# Altium schematic sheet Sheet1.schdoc
size A4
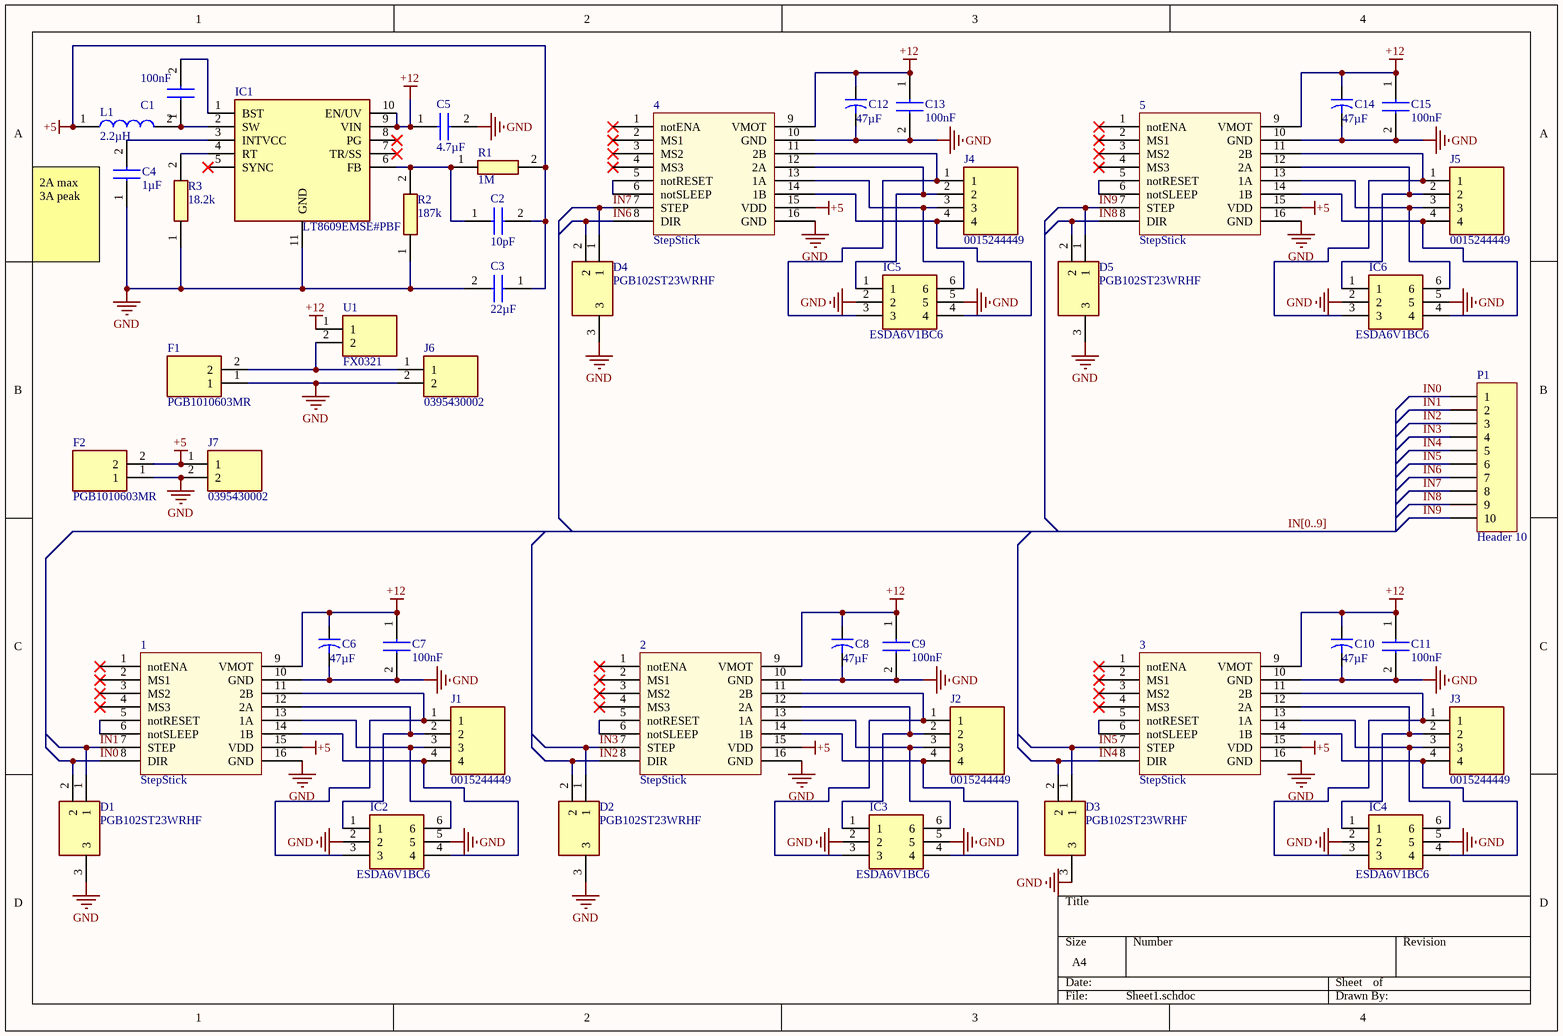
[diagram p0: Sheet1.schdoc]

## Parts
1  StepStick  [StepStick]
2  StepStick  [StepStick]
3  StepStick  [StepStick]
4  StepStick  [StepStick]
5  StepStick  [StepStick]
C1  100nF  [CAPC1608X95N]
C2  10pF  [CAPC1608X95N]
C3  22µF  [CAPC1608X95N]
C4  1µF  [CAPC1608X95N]
C5  4.7µF  [CAPC1608X95N]
C6  value 47µF  [CAPR5-4X5]
C7  100nF  [CAPC0603X33N]
C8  value 47µF  [CAPR5-4X5]
C9  100nF  [CAPC0603X33N]
C10  value 47µF  [CAPR5-4X5]
C11  100nF  [CAPC0603X33N]
C12  value 47µF  [CAPR5-4X5]
C13  100nF  [CAPC0603X33N]
C14  value 47µF  [CAPR5-4X5]
C15  100nF  [CAPC0603X33N]
D1  PGB102ST23WRHF  [PGB102ST23WRHF]
D2  PGB102ST23WRHF  [PGB102ST23WRHF]
D3  PGB102ST23WRHF  [PGB102ST23WRHF]
D4  PGB102ST23WRHF  [PGB102ST23WRHF]
D5  PGB102ST23WRHF  [PGB102ST23WRHF]
F1  PGB1010603MR  [FUSC1708X36N]
F2  PGB1010603MR  [FUSC1708X36N]
IC1  LT8609EMSE#PBF  [SOP50P490X110-11N]
IC2  ESDA6V1BC6  [SOT95P280X145-6N]
IC3  ESDA6V1BC6  [SOT95P280X145-6N]
IC4  ESDA6V1BC6  [SOT95P280X145-6N]
IC5  ESDA6V1BC6  [SOT95P280X145-6N]
IC6  ESDA6V1BC6  [SOT95P280X145-6N]
J1  0015244449  [0015244449]
J2  0015244449  [0015244449]
J3  0015244449  [0015244449]
J4  0015244449  [0015244449]
J5  0015244449  [0015244449]
J6  0395430002  [SHDR2W100P0X500_1X2_1000X950X1490P]
J7  0395430002  [SHDR2W100P0X500_1X2_1000X950X1490P]
L1  2.2µH  [WE-TPC_8015/801292]
P1  Header 10  [HDR1X10]
R1  1M  [RESC1608X55N]
R2  187k  [RESC1608X55N]
R3  18.2k  [RESC1608X55N]
U1  FX0321  [FX0321]

## Nets
+5: 1.15(VDD) 2.15(VDD) 3.15(VDD) 4.15(VDD) 5.15(VDD) C2.2 C3.1 F2.2 J7.1 L1.1 R1.2
+12: 1.9(VMOT) 2.9(VMOT) 3.9(VMOT) 4.9(VMOT) 5.9(VMOT) C5.1 C6.1 C7.1 C8.1 C9.1 C10.1 C11.1 C12.1 C13.1 C14.1 C15.1 IC1.9(VIN) IC1.10(EN/UV) U1.1
GND: 1.10(GND) 1.16(GND) 2.10(GND) 2.16(GND) 3.10(GND) 3.16(GND) 4.10(GND) 4.16(GND) 5.10(GND) 5.16(GND) C3.2 C4.1 C5.2 C6.2 C7.2 C8.2 C9.2 C10.2 C11.2 C12.2 C13.2 C14.2 C15.2 D1.3 D2.3 D3.3 D4.3 D5.3 F1.1 F2.1 IC1.11(GND) IC2.2 IC2.5 IC3.2 IC3.5 IC4.2 IC4.5 IC5.2 IC5.5 IC6.2 IC6.5 J6.2 J7.2 R2.1 R3.1
IN0: 1.8(DIR) D1.2 P1.1
IN1: 1.7(STEP) D1.1 P1.2
IN2: 2.8(DIR) D2.2 P1.3
IN3: 2.7(STEP) D2.1 P1.4
IN4: 3.8(DIR) D3.2 P1.5
IN5: 3.7(STEP) D3.1 P1.6
IN6: 4.8(DIR) D4.2 P1.7
IN7: 4.7(STEP) D4.1 P1.8
IN8: 5.8(DIR) D5.2 P1.9
IN9: 5.7(STEP) D5.1 P1.10
Net1_5: 1.5(notRESET) 1.6(notSLEEP)
Net1_11: 1.11(2B) IC2.3 J1.1
Net1_12: 1.12(2A) IC2.1 J1.2
Net1_13: 1.13(1A) IC2.6 J1.3
Net1_14: 1.14(1B) IC2.4 J1.4
Net2_5: 2.5(notRESET) 2.6(notSLEEP)
Net2_11: 2.11(2B) IC3.3 J2.1
Net2_12: 2.12(2A) IC3.1 J2.2
Net2_13: 2.13(1A) IC3.6 J2.3
Net2_14: 2.14(1B) IC3.4 J2.4
Net3_5: 3.5(notRESET) 3.6(notSLEEP)
Net3_11: 3.11(2B) IC4.3 J3.1
Net3_12: 3.12(2A) IC4.1 J3.2
Net3_13: 3.13(1A) IC4.6 J3.3
Net3_14: 3.14(1B) IC4.4 J3.4
Net4_5: 4.5(notRESET) 4.6(notSLEEP)
Net4_11: 4.11(2B) IC5.3 J4.1
Net4_12: 4.12(2A) IC5.1 J4.2
Net4_13: 4.13(1A) IC5.6 J4.3
Net4_14: 4.14(1B) IC5.4 J4.4
Net5_5: 5.5(notRESET) 5.6(notSLEEP)
Net5_11: 5.11(2B) IC6.3 J5.1
Net5_12: 5.12(2A) IC6.1 J5.2
Net5_13: 5.13(1A) IC6.6 J5.3
Net5_14: 5.14(1B) IC6.4 J5.4
NetC1_1: C1.1 IC1.2(SW) L1.2
NetC1_2: C1.2 IC1.1(BST)
NetC2_1: C2.1 IC1.6(FB) R1.1 R2.2
NetC4_2: C4.2 IC1.3(INTVCC)
NetF1_2: F1.2 J6.1 U1.2
NetIC1_4: IC1.4(RT) R3.2

Not connected (* = marked no-connect by the designer): 1 1(notENA)* 2(MS1)* 3(MS2)* 4(MS3)*; 2 1(notENA)* 2(MS1)* 3(MS2)* 4(MS3)*; 3 1(notENA)* 2(MS1)* 3(MS2)* 4(MS3)*; 4 1(notENA)* 2(MS1)* 3(MS2)* 4(MS3)*; 5 1(notENA)* 2(MS1)* 3(MS2)* 4(MS3)*; IC1 5(SYNC)* 7(TR/SS)* 8(PG)*

## Buses and harness runs
bus IN[0..9]

## Notes on the sheet
- 2A max 3A peak

## Library data of the parts
C1-C5 = C0603C104K3RACTU: Capacitor; Manufacturer_Name: Kemet; Allied_Number: 70095458; Datasheet Link: https://content.kemet.com/datasheets/KEM_C1002_X7R_SMD.pdf; Height: 0.95mm; Manufacturer_Part_Number: C0603C104K3RACTU; Mouser Part Number: 80-C0603C104K3R; Mouser Price/Stock: https://www.mouser.com/Search/Refine.aspx?Keyword=80-C0603C104K3R; RS Part Number: 0147538P; RS Price/Stock: http://uk.rs-online.com/web/p/products/0147538P; Allied Price/Stock: https://www.alliedelec.com/kemet-c0603c104k3ractu/70095458/
C6 C8 C10 C12 C14 = Cap2: Capacitor; Published: 23-Sep-2002; PackageReference: CAPR5-4X5; Publisher: Altium Limited; PackageDescription: Capacitor; 2 Leads
C7 C9 C11 C13 C15 = 02016D104KAT2A: Capacitor; Manufacturer_Name: AVX; Allied_Number: 70001761; Datasheet Link: http://www.mouser.com/catalog/supplier/library/pdf/AVXSurfaceMountCeramic.pdf; Height: 0.33mm; Manufacturer_Part_Number: 02016D104KAT2A; Mouser Part Number: 581-02016D104KAT2A; Mouser Price/Stock: https://www.mouser.com/Search/Refine.aspx?Keyword=581-02016D104KAT2A; RS Part Number: 6982995P; RS Price/Stock: http://uk.rs-online.com/web/p/products/6982995P; Allied Price/Stock: https://www.alliedelec.com/avx-02016d104kat2a/70001761/
D1-D5 = PGB102ST23WRHF: Diode; Manufacturer_Name: LITTELFUSE; Allied_Number: 70519251; Datasheet Link: https://www.arrow.com/en/products/pgb102st23wrhf/littelfuse; Height: 0.79mm; Manufacturer_Part_Number: PGB102ST23WRHF; Mouser Part Number: 576-PGB102ST23WRHF; Mouser Price/Stock: https://www.mouser.com/Search/Refine.aspx?Keyword=576-PGB102ST23WRHF; Allied Price/Stock: https://www.alliedelec.com/littelfuse-pgb102st23wrhf/70519251/
F1 F2 = PGB1010603MR: Fuse; Manufacturer_Name: LITTELFUSE; Allied_Number: 70184374; Datasheet Link: http://uk.rs-online.com/web/p/products/7383191; Height: 0.36mm; Manufacturer_Part_Number: PGB1010603MR; Mouser Part Number: 576-PGB1010603MR; Mouser Price/Stock: https://www.mouser.com/Search/Refine.aspx?Keyword=576-PGB1010603MR; RS Part Number: 7383191P; RS Price/Stock: http://uk.rs-online.com/web/p/products/7383191P; Allied Price/Stock: https://www.alliedelec.com/littelfuse-pgb1010603mr/70184374/
IC1 = LT8609EMSE#PBF: Integrated Circuit; Manufacturer_Name: Linear Technology; Datasheet Link: https://www.analog.com/media/en/technical-documentation/data-sheets/LT8609-8609A-8609B.pdf; Height: 1.1mm; Manufacturer_Part_Number: LT8609EMSE#PBF; Mouser Part Number: 584-LT8609EMSE#PBF; Mouser Price/Stock: https://www.mouser.com/Search/Refine.aspx?Keyword=584-LT8609EMSE%23PBF; RS Part Number: 1646081P; RS Price/Stock: http://uk.rs-online.com/web/p/products/1646081P
IC2-IC6 = ESDA6V1BC6: Integrated Circuit; Manufacturer_Name: STMicroelectronics; Allied_Number: 70389943; Datasheet Link: http://docs-emea.rs-online.com/webdocs/096e/0900766b8096e454.pdf; Height: 1.45mm; Manufacturer_Part_Number: ESDA6V1BC6; Mouser Part Number: 511-ESDA6V1BC6; Mouser Price/Stock: https://www.mouser.com/Search/Refine.aspx?Keyword=511-ESDA6V1BC6; RS Part Number: 0248805; RS Price/Stock: http://uk.rs-online.com/web/p/products/0248805; Allied Price/Stock: http://www.alliedelec.com/stmicroelectronics-esda6v1bc6/70389943/
J1-J5 = 0015244449: Connector; Manufacturer_Name: Molex; Datasheet Link: https://www.molex.com/pdm_docs/sd/015244449_sd.pdf; Height: 10.66mm; Manufacturer_Part_Number: 0015244449; Mouser Part Number: N/A; Mouser Price/Stock: https://www.mouser.com/Search/Refine.aspx?Keyword=N%2FA
J6 J7 = 0395430002: Connector; Manufacturer_Name: Molex; Datasheet Link: https://www.molex.com/pdm_docs/sd/395430002_sd.pdf; Height: 14.9mm; Manufacturer_Part_Number: 0395430002; Mouser Part Number: N/A; Mouser Price/Stock: https://www.mouser.com/Search/Refine.aspx?Keyword=N%2FA
L1 = 7440680150: Inductor; Manufacturer_Name: Wurth Elektronik; Manufacturer_Part_Number: 7440680150; Mouser Part Number: 710-7440680150; Mouser Price/Stock: https://www.mouser.com/Search/Refine.aspx?Keyword=710-7440680150; RS Part Number: 8008134; RS Price/Stock: https://uk.rs-online.com/web/p/products/8008134
P1 = Header 10: Header, 10-Pin; LatestRevisionDate: 17-Jul-2002; LatestRevisionNote: Re-released for DXP Platform.; Publisher: Altium Limited
R1-R3 = CR0603-FX-1004ELF: Resistor; Manufacturer_Name: Bourns; Allied_Number: 70408507; Datasheet Link: https://www.bourns.com/pdfs/chpreztr.pdf; Height: 0.55mm; Manufacturer_Part_Number: CR0603-FX-1004ELF; Mouser Part Number: 652-CR0603FX-1004ELF; Mouser Price/Stock: https://www.mouser.com/Search/Refine.aspx?Keyword=652-CR0603FX-1004ELF; RS Part Number: 7408814P; RS Price/Stock: http://uk.rs-online.com/web/p/products/7408814P; Allied Price/Stock: https://www.alliedelec.com/bourns-cr0603-fx-1004elf/70408507/
U1 = FX0321: Undefined or Miscellaneous; Manufacturer_Name: Bulgin; Datasheet Link: http://docs-emea.rs-online.com/webdocs/152b/0900766b8152bdd4.pdf; Manufacturer_Part_Number: FX0321; Mouser Part Number: 422-FX0321; Mouser Price/Stock: https://www.mouser.com/Search/Refine.aspx?Keyword=422-FX0321; RS Part Number: 0417098; RS Price/Stock: http://uk.rs-online.com/web/p/products/0417098